# Altium schematic sheet 2.SchDoc
size B
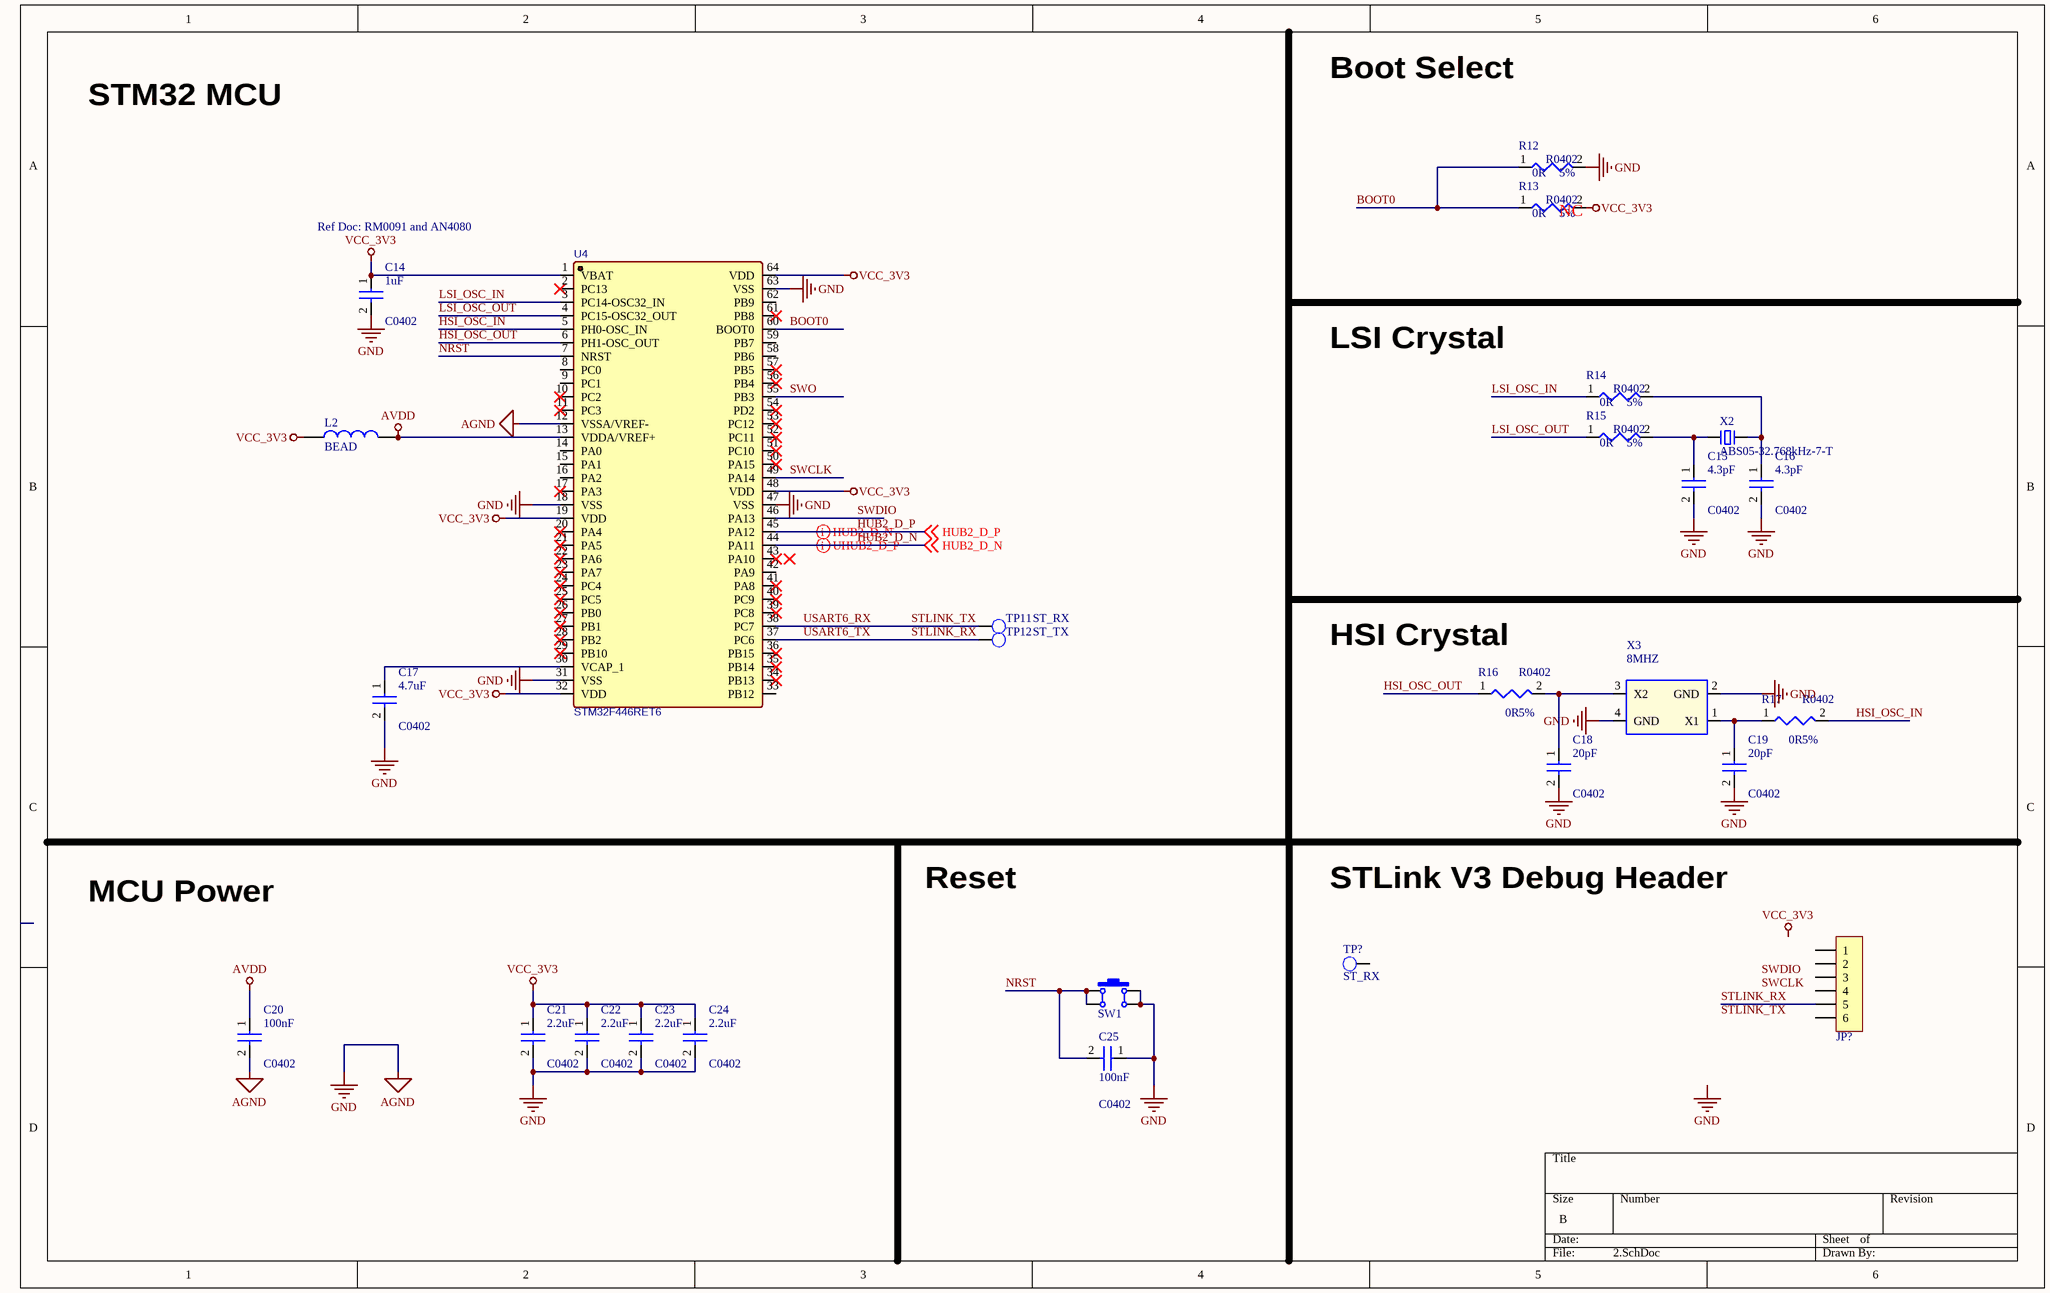
[diagram p0: 2.SchDoc]

## Parts
C14  1uF  PCB Footprint: C0402  [C0402_L]
C15  4.3pF  PCB Footprint: C0402  [C0402_L]
C16  4.3pF  PCB Footprint: C0402  [C0402_L]
C17  4.7uF  PCB Footprint: C0402  [C0402_L]
C18  20pF  PCB Footprint: C0402  [C0402_L]
C19  20pF  PCB Footprint: C0402  [C0402_L]
C20  100nF  PCB Footprint: C0402  [C0402_L]
C21  2.2uF  PCB Footprint: C0402  [C0402_L]
C22  2.2uF  PCB Footprint: C0402  [C0402_L]
C23  2.2uF  PCB Footprint: C0402  [C0402_L]
C24  2.2uF  PCB Footprint: C0402  [C0402_L]
C25  100nF  PCB Footprint: C0402  [C0402_L]
JP?  HDR-1X6  [HDR2.0-M-LI-6P]  (value not drawn)
L2  BEAD  [L0402]
R12  0R  Tolerance: 5%  [R0402]
R13  0R  Tolerance: 5%  [R0402]  (net tie, no BOM)
R14  0R  Tolerance: 5%  [R0402]
R15  0R  Tolerance: 5%  [R0402]
R16  0R  Tolerance: 5%  [R0402]
R17  0R  Tolerance: 5%  [R0402]
SW1  6x6x1.5  [TSW SMD-6*6*5]  (value not drawn)
TP11  ST_RX  [TP_0R70]  (no BOM)
TP12  ST_TX  [TP_0R70]  (no BOM)
TP?  ST_RX  [TP_0R70]  (no BOM)
U4  STM32F446RET6  [LQFP64_L]
X2  ABS05-32.768kHz-7-T  [XTAL_3215]
X3  8MHZ  [XTAL_3225]

## Nets
AGND: C14.2 C15.2 C16.2 C17.2 C18.2 C19.2 C20.2 C21.2 C22.2 C23.2 C24.2 C25.1 R12.2 SW1.2 SW1.3 U4.12(VSSA/VREF-) U4.18(VSS) U4.31(VSS) U4.47(VSS) U4.63(VSS) X3.2(GND) X3.4(GND)  [also labelled GND]
AVDD: C20.1 L2.2 U4.13(VDDA/VREF+)
VCC_3V3: C14.1 C21.1 C22.1 C23.1 C24.1 L2.1 R13.2 U4.1(VBAT) U4.19(VDD) U4.32(VDD) U4.48(VDD) U4.64(VDD)
BOOT0: R12.1 R13.1 U4.60(BOOT0)
HSI_OSC_IN: R17.2 U4.5(PH0-OSC_IN)
HSI_OSC_OUT: R16.1 U4.6(PH1-OSC_OUT)
HUB2_D_N: U4.44(PA11) ; off-sheet HUB2_D_N
HUB2_D_P: U4.45(PA12) ; off-sheet HUB2_D_P
LSI_OSC_IN: R14.1 U4.3(PC14-OSC32_IN)
LSI_OSC_OUT: R15.1 U4.4(PC15-OSC32_OUT)
NRST: C25.2 SW1.1 SW1.4 U4.7(NRST)
STLINK_RX: JP?.5 TP12.1 U4.37(PC6)  [also labelled USART6_TX]
STLINK_TX: TP11.1 U4.38(PC7)  [also labelled USART6_RX]
SWCLK: U4.49(PA14)
SWDIO: U4.46(PA13)
SWO: U4.55(PB3)
NetC15_1: C15.1 R15.2 X2.1
NetC16_1: C16.1 R14.2 X2.2
NetC17_1: C17.1 U4.30(VCAP_1)
NetC18_1: C18.1 R16.2 X3.3(X2)
NetC19_1: C19.1 R17.1 X3.1(X1)

Not connected (* = marked no-connect by the designer): JP? 1 2 3 4 6; TP? 1; U4 2(PC13)* 8(PC0) 9(PC1) 10(PC2)* 11(PC3)* 14(PA0) 15(PA1) 16(PA2) 17(PA3)* 20(PA4)* 21(PA5)* 22(PA6)* 23(PA7)* 24(PC4)* 25(PC5)* 26(PB0)* 27(PB1)* 28(PB2)* 29(PB10)* 33(PB12) 34(PB13)* 35(PB14)* 36(PB15)* 39(PC8)* 40(PC9)* 41(PA8)* 42(PA9) 43(PA10)* 50(PA15)* 51(PC10)* 52(PC11)* 53(PC12)* 54(PD2)* 56(PB4)* 57(PB5)* 58(PB6) 59(PB7) 61(PB8)* 62(PB9)

## Layout directives
differential pair; differential pair class USB: HUB2_D_N, HUB2_D_P

## Notes on the sheet
- Boot Select
- STM32 MCU
- Ref Doc: RM0091 and AN4080
- (near R13) NC
- LSI Crystal
- (near R16) HSI Crystal
- MCU Power
- Reset
- STLink V3 Debug Header
- Labels drawn without touching a wire or pin: GND, SWCLK, SWDIO, VCC_3V3

## Library data of the parts
C14 = CAP NP_Dup1: cap,1.00uF,+/-10%,10V,X5R,C0402; Manufacturer_Name: Open/Any; Priority: A; Part Type: Capacitor; Package: 0402; Manufacturer_Part_Number: Open/Any
C15 C16 = CAP NP_Dup1: cap,4.3pF,+/-10%,25V,X5R,C0402; Manufacturer_Name: Open/Any; Priority: A; Part Type: Capacitor; Package: 0402; Manufacturer_Part_Number: Open/Any
C17 = CAP NP_Dup1: cap,4.70uF,+/-10%,6.3V,X5R,C0402; Manufacturer_Name: Open/Any; Priority: A; Part Type: Capacitor; Package: 0402; Manufacturer_Part_Number: Open/Any
C18 C19 = CAP NP_Dup1: cap,20pF,+/-10%,25V,X5R,C0402; Manufacturer_Name: Open/Any; Priority: A; Part Type: Capacitor; Package: 0402; Manufacturer_Part_Number: Open/Any
C20 C25 = CAP NP_Dup1: cap,100.00nF,+/-10%,10V,X5R,C0402; Manufacturer_Name: Open/Any; Priority: A; Part Type: Capacitor; Package: 0402; Manufacturer_Part_Number: Open/Any
C21-C24 = CAP NP_Dup1: cap,2.20uF,+/-10%,10V,X5R,C0402; Manufacturer_Name: Open/Any; Priority: A; Part Type: Capacitor; Package: 0402; Manufacturer_Part_Number: Open/Any
JP? = Header 6: 6P接插件; 封装库来自淘宝卖家 ID：黄晶宝石: https://shop463601444.taobao.com
L2 = L-AL: 鐵氧體磁珠 33ohm 0.55A 550mOhms 0402 Chip Bead; Manufacturer_Name: TDK; Manufacturer_Part_Number: MPZ0402S330CTF0W; PCB Footprint: 0402; Part Type: BEAD; Package: 0402
R12-R17 = RESISTOR: 通用厚膜电阻,0R,+/-5%,R0402; Manufacturer_Name: Open/Any; Priority: A; PCB Footprint: R0402; Part Type: Resistor; Package: 0402; Manufacturer_Part_Number: Open/Any
SW1 = SW SMD-4x4: 贴片6x6x1.5 轻触开关; Part Type: Mount Hole
TP11 TP12 TP? = TP: Test Point 0.7mm; PCB Footprint: TP_0R50; Priority: A; Part Type: TP
U4 = STM32F446RET6: Manufacturer_Name: STMicroelectronics; PCB Footprint: LQFP64; Package: LQFP64; Part Type: Microcontroller; Manufacturer_Part_Number: STM32F446RE
X2 = XTAL-2P: ABS05-32.768kHz-7-T / 3215 2脚无源晶振(谐振器）; Manufacturer_Name: Open/Any; Manufacturer_Part_Number: Open/Any
X3 = CRYSTAL_4P: 8MHZ (16pF), 3.2 mm x 2.5 mm / 无源晶振(谐振器）; Manufacturer_Name: Open/Any; Manufacturer_Part_Number: Open/Any